# Altium schematic sheet analog.SchDoc: DiPho_analog
size 420 x 297 mm; Author: P. Daniel; CompanyName: WUT ISE; DrawnBy: P. Daniel; Organization: WUT ISE; Address1: PW ISE; Address2: Nowowiejska 15/19 00-665 Warsaw; Address3: piotrmaciejdaniel@gmail.com; Revision: 2; SheetNumber: 1; SheetTotal: 4; ModifiedBy: -; CheckedDate: -; Title2: AFE board for DiPho sensor; DivGrp: WUT ISE; Designer: Piotr Daniel; ModifiedDate: -; ProjectName: Sensor Box
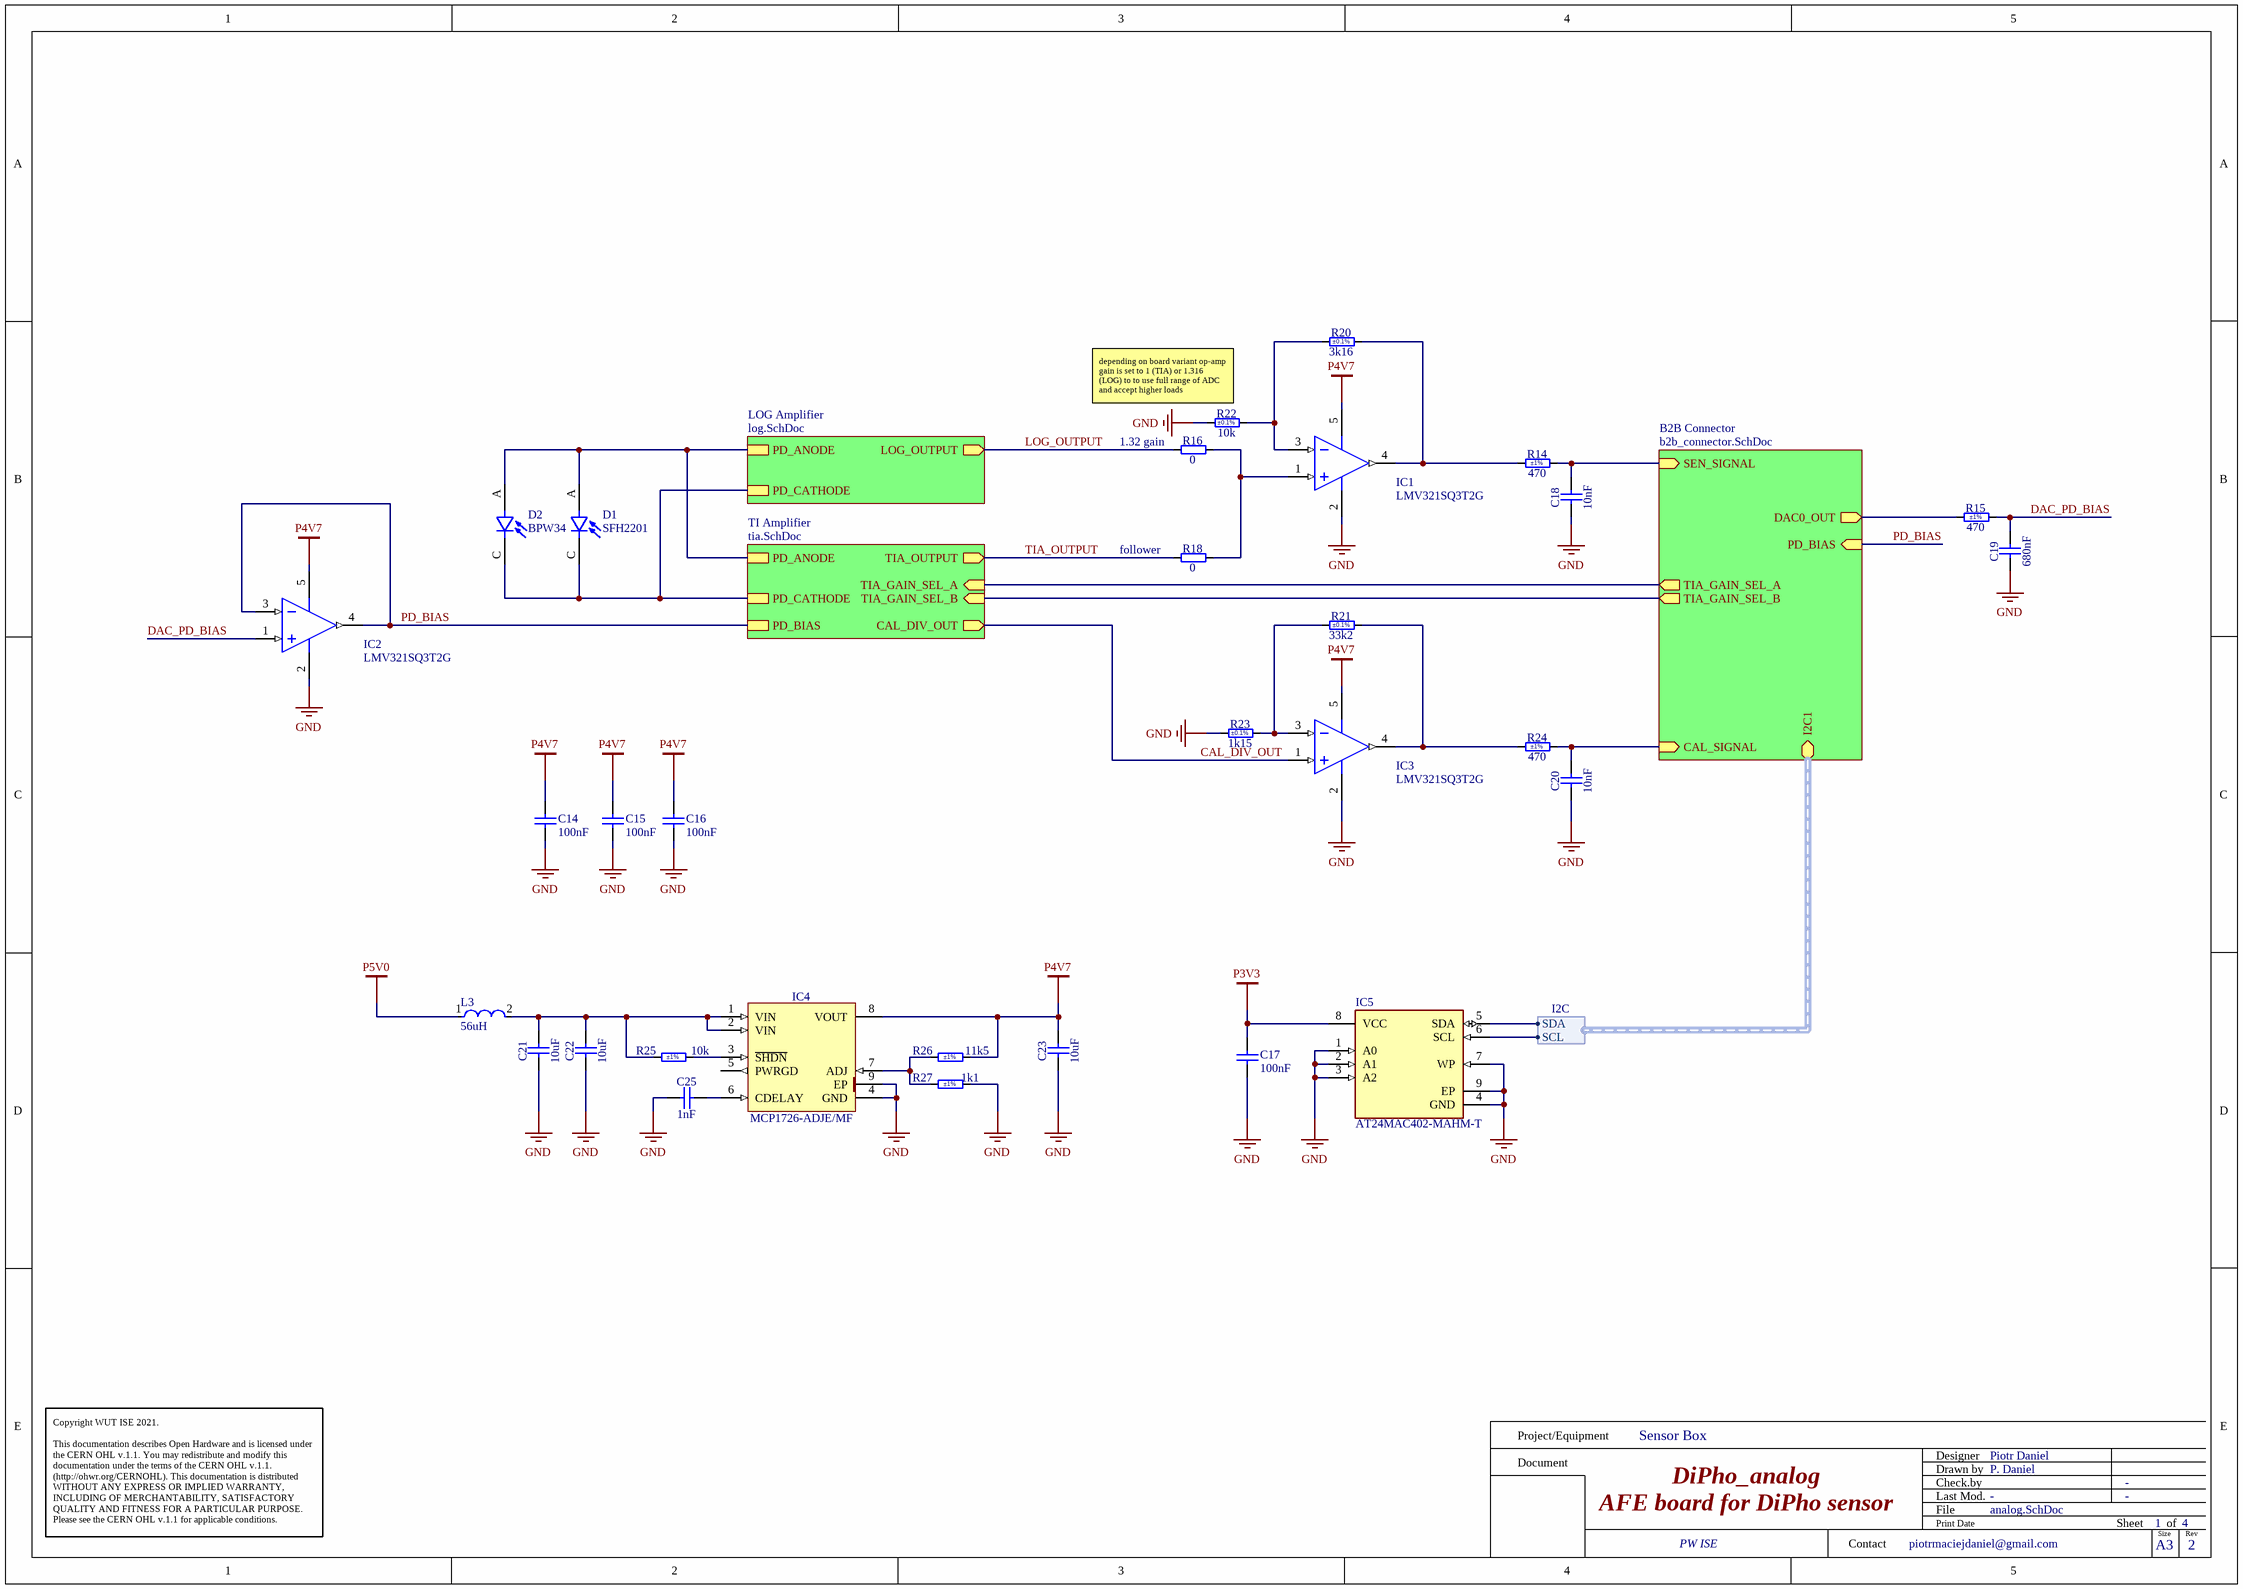
[diagram p0: analog.SchDoc]

## Parts
C14  100nF  [CAPC1005X55N]
C15  100nF  [CAPC1005X55N]
C16  100nF  [CAPC1005X55N]
C17  100nF  [CAPC1005X55N]
C18  10nF  [CAPC1005X55N]
C19  680nF  [CAPC1005X55N]
C20  10nF  [CAPC1005X55N]
C21  10uF  [CAPC2012X135N]
C22  10uF  [CAPC2012X135N]
C23  10uF  [CAPC2012X135N]
C25  1nF  [CAPC1005X55N]
D1  SFH2201  [SFH_2201]
D2  BPW34  [BPW34]
IC1  LMV321SQ3T2G  [ONSC-SC70-5-419A-02_K_N]
IC2  LMV321SQ3T2G  [ONSC-SC70-5-419A-02_K_N]
IC3  LMV321SQ3T2G  [ONSC-SC70-5-419A-02_K_N]
IC4  MCP1726-ADJE/MF  [SON65P300X300X100-9N-R160X240]
IC5  AT24MAC402-MAHM-T  [FP-C04-21355-Q4B-MFG]
L3  56uH  [FP-LQH3NPH_ME-MFG]
R14  470  Tolerance: ±1%  [RESC1005X40N]
R15  470  Tolerance: ±1%  [RESC1005X40N]
R16  0  [RESC1005X40N]
R18  0  [RESC1005X40N]
R20  3k16  Tolerance: ±0.1%  [RESC1005X35N]
R21  33k2  Tolerance: ±0.1%  [RESC1005X40N]
R22  10k  Tolerance: ±0.1%  [RESC1005X35N]
R23  1k15  Tolerance: ±0.1%  [RESC1005X35N]
R24  470  Tolerance: ±1%  [RESC1005X40N]
R25  10k  Tolerance: ±1%  [RESC1005X40N]
R26  11k5  Tolerance: ±1%  [RESC1005X40N]
R27  1k1  Tolerance: ±1%  [RESC1005X40N]

## Sub-sheets
B2B Connector = b2b_connector.SchDoc: TIA_GAIN_SEL_A (out), TIA_GAIN_SEL_B (out), I2C1 (bidir, harness I2C), CAL_SIGNAL (in), SEN_SIGNAL (in), DAC0_OUT (out), PD_BIAS (in)
LOG Amplifier = log.SchDoc: LOG_OUTPUT (out), PD_ANODE, PD_CATHODE
TI Amplifier = tia.SchDoc: PD_ANODE, PD_CATHODE, TIA_OUTPUT (out), TIA_GAIN_SEL_A (in), TIA_GAIN_SEL_B (in), PD_BIAS, CAL_DIV_OUT (out)

## Harnesses
I2C: SCL, SDA

## Nets
GND: C14.1 C15.1 C16.1 C17.1 C18.1 C19.1 C20.1 C21.1 C22.1 C23.1 C25.1 IC1.2(V-) IC2.2(V-) IC3.2(V-) IC4.4(GND) IC4.9(EP) IC5.1(A0) IC5.2(A1) IC5.3(A2) IC5.4(GND) IC5.7(WP) IC5.9(EP) R22.1 R23.1 R27.2
P3V3: C17.2 IC5.8(VCC)
P4V7: C14.2 C15.2 C16.2 C23.2 IC1.5(V+) IC2.5(V+) IC3.5(V+) IC4.8(VOUT) R26.2
P5V0: L3.1
CAL_DIV_OUT: IC3.1(IN+) ; sheet TI Amplifier/CAL_DIV_OUT
DAC_PD_BIAS: C19.2 IC2.1(IN+) R15.2
LOG_OUTPUT: R16.1 ; sheet LOG Amplifier/LOG_OUTPUT
PD_BIAS: IC2.3(IN-) IC2.4(OUT) ; sheet TI Amplifier/PD_BIAS, sheet B2B Connector/PD_BIAS
TIA_OUTPUT: R18.1 ; sheet TI Amplifier/TIA_OUTPUT
NetC18_2: C18.2 R14.2 ; sheet B2B Connector/SEN_SIGNAL
NetC20_2: C20.2 R24.2 ; sheet B2B Connector/CAL_SIGNAL
NetC21_2: C21.2 C22.2 IC4.1(VIN) IC4.2(VIN) L3.2 R25.1
NetC25_2: C25.2 IC4.6(CDELAY)
NetD1_A: D1.A D2.A ; sheet LOG Amplifier/PD_ANODE, sheet TI Amplifier/PD_ANODE
NetD1_C: D1.C D2.C ; sheet LOG Amplifier/PD_CATHODE, sheet TI Amplifier/PD_CATHODE
NetIC1_1: IC1.1(IN+) R16.2 R18.2
NetIC1_3: IC1.3(IN-) R20.1 R22.2
NetIC1_4: IC1.4(OUT) R14.1 R20.2
NetIC3_3: IC3.3(IN-) R21.1 R23.2
NetIC3_4: IC3.4(OUT) R21.2 R24.1
NetIC4_3: IC4.3(~{SHDN}) R25.2
NetIC4_7: IC4.7(ADJ) R26.1 R27.1
NetIC5_5: IC5.5(SDA) ; sheet B2B Connector/I2C1.SDA
NetIC5_6: IC5.6(SCL) ; sheet B2B Connector/I2C1.SCL
NetR15_1: R15.1 ; sheet B2B Connector/DAC0_OUT
(unnamed): sheet TI Amplifier/TIA_GAIN_SEL_A, sheet B2B Connector/TIA_GAIN_SEL_A
(unnamed): sheet TI Amplifier/TIA_GAIN_SEL_B, sheet B2B Connector/TIA_GAIN_SEL_B

Not connected (* = marked no-connect by the designer): IC4 5(PWRGD)

## Notes on the sheet
- (near R22) depending on board variant op-amp gain is set to 1 (TIA) or 1.316 (LOG) to to use full range of ADC and accept higher loads
- (near R16) 1.32 gain
- (near R18) follower
- Project/Equipment
- Document
- Designer
- Drawn by
- Check.by
- Copyright WUT ISE 2021.
  This documentation describes Open Hardware and is licensed under the CERN OHL v.1.1. You may redistribute and modify this documentation under the terms of the CERN OHL v.1.1. (http://ohwr.org/CERNOHL). This documentation is distributed WITHOUT ANY EXPRESS OR IMPLIED WARRANTY, INCLUDING OF MERCHANTABILITY, SATISFACTORY QUALITY AND FITNESS FOR A PARTICULAR PURPOSE. Please see the CERN OHL v.1.1 for applicable conditions.
- Contact
- File
- Last Mod.
- Print Date
- Sheet
- Size
- A3
- of
- Rev

## Library data of the parts
C14-C17 = CC0402_100NF_16V_10%_X7R: Non-polarised capacitor; Manufacturer: GENERIC; Part Description: SMD Multilayer Chip Ceramic Capacitor; Manufacturer1 Part Number: GRM155R71C104KA88D; Tolerance: ±10%; Voltage: 16V; TC: X7R; Part Number: CC0402_100NF_16V_10%_X7R; Component Kind: Standard; Component Type: Standard; Pin Count: 2; Value: 100nF; Status: Not Recommended; Manufacturer Part Number: CC0402_100NF_16V_10%_X7R; Case: 0402; Mounted: Yes; Socket: No; SMD: Yes; Sense: No; Manufacturer1 Example: MURATA; Manufacturer1 ComponentHeight: 0.55mm; HelpURL: \\cern.ch\dfs\Applications\Altium\Datasheets\CC0402_X7R_MURATA_GRM.pdf; Author: CERN DEM JLC; CreateDate: 05.12.2013; LatestRevisionDate: 03.12.2007
C18 C20 = CC0402_10NF_16V_10%_X7R: Non-polarised capacitor; Part Description: SMD Multilayer Chip Ceramic Capacitor; Manufacturer: GENERIC; Manufacturer1 Part Number: 223878715636; Voltage: 16V; TC: X7R; Tolerance: ±10%; Part Number: CC0402_10NF_16V_10%_X7R; Component Kind: Standard; Component Type: Standard; Pin Count: 2; Value: 10nF; Status: Not Recommended; Manufacturer Part Number: CC0402_10NF_16V_10%_X7R; Case: 0402; Mounted: Yes; Socket: No; SMD: Yes; Sense: No; Manufacturer1 Example: PHYCOMP; Manufacturer1 ComponentHeight: 0.55mm; HelpURL: \\cern.ch\dfs\Applications\Altium\Datasheets\CC0402_X7R_PHYCOMP.pdf; Author: CERN DEM JLC; CreateDate: 03.12.2007; LatestRevisionDate: 03.12.2007
C19 = CC0402_680NF_10V_10%_X5R: Non-polarised capacitor; Part Description: SMD Multilayer Chip Ceramic Capacitor; Manufacturer: GENERIC; Manufacturer1 Part Number: GRM155R61A684KE15; Voltage: 10V; TC: X5R; Tolerance: ±10%; Part Number: CC0402_680NF_10V_10%_X5R; Component Kind: Standard; Component Type: Standard; Pin Count: 2; Value: 680nF; Status: None; Manufacturer Part Number: CC0402_680NF_10V_10%_X5R; Case: 0402; Mounted: Yes; Socket: No; SMD: Yes; Sense: No; Manufacturer1 Example: MURATA; Manufacturer1 ComponentHeight: 0.55mm; HelpURL: \\cern.ch\dfs\Applications\Altium\Datasheets\CC0402_X5R_MURATA_GRM.pdf; Author: CERN DEM BC; CreateDate: 19.04.2021; LatestRevisionDate: 19.04.2021
C21-C23 = CC0805_10UF_10V_10%_X7R: Non-polarised capacitor; Part Description: SMD Multilayer Chip Ceramic Capacitor; Manufacturer: GENERIC; Manufacturer1 Part Number: GRM21BR71A106KE51L; Voltage: 10V; TC: X7R; Tolerance: ±10%; Part Number: CC0805_10UF_10V_10%_X7R; Component Kind: Standard; Component Type: Standard; Pin Count: 2; Value: 10uF; Status: Preferred; Manufacturer Part Number: CC0805_10UF_10V_10%_X7R; Case: 0805; Mounted: Yes; Socket: No; SMD: Yes; Sense: No; Manufacturer1 Example: MURATA; Manufacturer1 ComponentHeight: 1.35mm; HelpURL: \\cern.ch\dfs\Applications\Altium\Datasheets\CC0805_X7R_MURATA.pdf; Author: CERN DEM JLC; CreateDate: 30.04.2012; LatestRevisionDate: 30.04.2012
C25 = CC0402_1NF_50V_10%_X7R: Non-polarised capacitor; Part Description: SMD Multilayer Chip Ceramic Capacitor; Manufacturer: GENERIC; Manufacturer1 Part Number: 223858715623; Voltage: 50V; TC: X7R; Tolerance: ±10%; Part Number: CC0402_1NF_50V_10%_X7R; Component Kind: Standard; Component Type: Standard; Pin Count: 2; Value: 1nF; Status: Not Recommended; Manufacturer Part Number: CC0402_1NF_50V_10%_X7R; Case: 0402; Mounted: Yes; Socket: No; SMD: Yes; Sense: No; Manufacturer1 Example: PHYCOMP; Manufacturer1 ComponentHeight: 0.55mm; HelpURL: \\cern.ch\dfs\Applications\Altium\Datasheets\CC0402_X7R_PHYCOMP.pdf; Author: CERN DEM JLC; CreateDate: 03.12.2007; LatestRevisionDate: 03.12.2007
D2 = BPW34: VISHAY - BPW34 - Photodiode, 65 °, 2 nA, 900 nm, DIP-2; Wavelength: 900nm; Rise Time: 100ns; Dark Current: 2nA; Power Dissipation: 215mW; Reverse Breakdown Voltage: 60V; Viewing Angle: 130°; Diode Type: PIN; Lens Style: Clear; Supplier 1: Digi-Key; Manufacturer: Vishay; Manufacturer Part Number: BPW34; RoHS: Yes; Category: Photodiodes; Stock 1: 56; Pricing 1: 1=1,06000, 10=0,94400, 100=0,73630, 500=0,60822, 1000=0,48018, 2000=0,45300 (USD); Mount: Through Hole,PCB; Case/Package: DIP; Number of Pins: 2; Contact Plating: Tin; Min Operating Temperature: -40°C; Max Operating Temperature: 100°C; Fall Time: 100ns; Packaging: Bulk; Max Reverse Voltage (DC): 60V; Package Quantity: 3000; Max Power Dissipation: 215mW; Reverse Voltage (DC): 60V; Breakdown Voltage: 60V; Length: 4.5mm; Width: 4.3mm; Height: 2mm; Radiation Hardening: No; REACH SVHC: Unknown; Lead Free: Lead Free; ComponentLink1URL: https://datasheet.ciiva.com/1248/33605-1248690.pdf?src-supplier=Element14; ComponentLink1Description: https://datasheet.ciiva.com/1248/33605-1248690.pdf?src-supplier=Element14; ComponentLink2URL: https://datasheet.ciiva.com/1249/bpw34-1249073.pdf?src-supplier=Element14; ComponentLink2Description: https://datasheet.ciiva.com/1249/bpw34-1249073.pdf?src-supplier=Element14; ComponentLink3URL: https://datasheet.ciiva.com/25620/0900766b80de9fc5-25620357.pdf?src-supplier=RSComponents; ComponentLink3Description: https://datasheet.ciiva.com/25620/0900766b80de9fc5-25620357.pdf?src-supplier=RSComponents; ComponentLink4URL: https://datasheet.ciiva.com/4697/bpw34-79369-4697616.pdf?src-supplier=Mouser; ComponentLink4Description: https://datasheet.ciiva.com/4697/bpw34-79369-4697616.pdf?src-supplier=Mouser; ComponentLink5URL: https://datasheet.ciiva.com/1336/6514-1336219.pdf?src-supplier=Newark; ComponentLink5Description: https://datasheet.ciiva.com/1336/6514-1336219.pdf?src-supplier=Newark; ComponentLink6URL: https://datasheet.ciiva.com/4269/2bpw34-4269812.pdf?src-supplier=Arrow+Electronics; ComponentLink6Description: https://datasheet.ciiva.com/4269/2bpw34-4269812.pdf?src-supplier=Arrow+Electronics; ComponentLink7URL: https://datasheet.ciiva.com/15117/getdatasheetpartid-112064-15117125.pdf?src-supplier=Verical; ComponentLink7Description: https://datasheet.ciiva.com/15117/getdatasheetpartid-112064-15117125.pdf?src-supplier=Verical; ComponentLink8URL: https://datasheet.ciiva.com/1248/bpw34-1248686.pdf?src-supplier=Element14; ComponentLink8Description: https://datasheet.ciiva.com/1248/bpw34-1248686.pdf?src-supplier=Element14; ComponentLink9URL: https://datasheet.ciiva.com/1335/1809684-1335889.pdf?src-supplier=Newark; ComponentLink9Description: https://datasheet.ciiva.com/1335/1809684-1335889.pdf?src-supplier=Newark; ComponentLink10URL: https://datasheet.ciiva.com/2819/bpw34-2819744.pdf?src-supplier=Digi-Key; ComponentLink10Description: https://datasheet.ciiva.com/2819/bpw34-2819744.pdf?src-supplier=Digi-Key; ComponentLink11URL: https://datasheet.ciiva.com/8084/bpw34-8084840.pdf?src-supplier=Avnet; ComponentLink11Description: https://datasheet.ciiva.com/8084/bpw34-8084840.pdf?src-supplier=Avnet; Supplier Part Number 1: 751-1015-ND
IC1-IC3 = CMP-1310-00136-1: Single Low-Voltage, Rail-to-Rail Operational Amplifier, 2.7 to 5.5 V, -40 to 85 degC, 5-Pin SC70, Pb-Free, Tape and Reel; Manufacturer: On Semiconductor; VCC Max (V): 5.5; VCC Min (V): 2.7; SR Typ (V/uS): 1; ComponentLink2Description: Datasheet; ComponentLink1URL: http://www.onsemi.com/; DatasheetVersion: Rev. 10; PackageDescription: 5-Pin Small Outline Transistor, Body 2 x 1.25 mm, Pitch 0.65 mm; PartNumber: LMV321SQ3T2G; Packing: Tape and Reel; PackageVersion: Rev. K, 07/2010; ComponentLink1Description: Manufacturer URL; PackageReference: SC70-5-419A-02_K; ComponentLink3Description: Package Specification; GBW Typ (MHz): 1; ComponentLink3URL: http://www.onsemi.cn/pub_link/Collateral/LMV821-D.PDF; ComponentLink2URL: http://www.onsemi.cn/pub_link/Collateral/LMV321-LMV358-LMV324-D.PDF; Mounting Technology: Surface Mount; RoHS: TRUE
IC4 = MCP1726-ADJE/MF: 1A, 0.8V to 5.0V Adjustable , Low Quiescent Current LDO Regulator; Manufacturer: MICROCHIP TECHNOLOGY; PressFit: No; Bonding: No; Part Number: MCP1726-ADJE/MF; Component Kind: Standard; Component Type: Standard; Device: MCP1726-ADJE/MF; PackageDescription: SON, 0.65mm pitch, 8 pin, 3mm X 3mm X 1.00mm H body (w/thermal tab 1.60 X 2.4mm),  IPC Medium Density; Part Description: 1A, 0.8V to 5.0V Adjustable, Low Quiescent Current LDO Regulator; Manufacturer Part Number: MCP1726-ADJE/MF; Pin Count: 8; Case: SON8; Mounted: Yes; Socket: No; SMD: Yes; Sense: No; ComponentHeight: 1mm; HelpURL: \\cern.ch\dfs\Applications\Altium\Datasheets\MCP1726-ADJE-MF.pdf; Author: CERN DEM JLC; CreateDate: 07.02.2012; LatestRevisionDate: 07.02.2012
IC5 = CMP-06313-000089-1: IC EEPROM 2K I2C 1MHZ 8UDFN; Memory Size: 2Kb; Access Time: 550ns; Memory Type: Non-Volatile; Max Operating Temperature: 85°C; Frequency: 1MHz; Min Operating Temperature: -40°C; Packaging: Cut Tape; RoHS Compliant: Yes; Mount: Surface Mount
L3 = CMP-06042-011728-1: Wire Wound Ferrite Inductor for Power Lines 56μH ±20% 1.2Ω 500mA 1212
R14 R15 R24 = R0402_470R_1%_0.0625W_100PPM: Resistor - 1%; Part Description: General Purpose Thick Film Chip Resistor; Manufacturer: GENERIC; Manufacturer1 Part Number: 232270674701L; TC: ±100ppm/°C; PressFit: No; Part Number: R0402_470R_1%_0.0625W_100PPM; Component Kind: Standard; Component Type: Standard; Pin Count: 2; Value: 470; Status: Not Recommended; Power: 0.0625W; Manufacturer Part Number: R0402_470R_1%_0.0625W_100PPM; Case: 0402; Mounted: Yes; Sense: No; Socket: No; SMD: Yes; Manufacturer1 Example: YAGEO PHYCOMP; Manufacturer1 ComponentHeight: 0.4mm; HelpURL: \\cern.ch\dfs\Applications\Altium\Datasheets\R0402_Phycomp_RC0402.pdf; Author: CERN DEM JLC; CreateDate: 03.12.2007; LatestRevisionDate: 17.10.2012
R16 R18 = R0402_0R_JUMPER: Resistor; Part Description: 1A (0.05R Max DC Resistance) Zero Ohm Jumper; Manufacturer: GENERIC; Manufacturer1 Part Number: 232270591001L; PressFit: No; Part Number: R0402_0R_JUMPER; Component Kind: Standard; Component Type: Standard; Pin Count: 2; Value: 0; Status: Not Recommended; Manufacturer Part Number: R0402_0R_JUMPER; Case: 0402; Mounted: Yes; Sense: No; Socket: No; SMD: Yes; Manufacturer1 Example: YAGEO PHYCOMP; Manufacturer1 ComponentHeight: 0.4mm; HelpURL: \\cern.ch\dfs\Applications\Altium\Datasheets\R0402_Phycomp_RC0402.pdf; Author: CERN DEM JLC; CreateDate: 03.12.2007; LatestRevisionDate: 17.10.2012
R20 R23 = R0402_10K_0.1%_0.063W_25PPM: Resistor - 0.1%; Part Description: Thin Film Precision Resistor; Manufacturer: GENERIC; Manufacturer1 Part Number: CPF0402B10KE1; Value: 10k; Power: 0.063W; TC: ±25ppm/°C; PressFit: No; Part Number: R0402_10K_0.1%_0.063W_25PPM; Component Kind: Standard; Component Type: Standard; Pin Count: 2; Status: Not Recommended; Manufacturer Part Number: R0402_10K_0.1%_0.063W_25PPM; Case: 0402; Mounted: Yes; Sense: No; Socket: No; SMD: Yes; Manufacturer1 Example: TE CONNECTIVITY; Manufacturer1 ComponentHeight: 0.35mm; HelpURL: \\cern.ch\dfs\Applications\Altium\Datasheets\R0402_TYCO_CPF.pdf; Author: CERN DEM JMW; CreateDate: 22.09.2015; LatestRevisionDate: 22.09.2015
R21 = R0402_33K2_0.1%_0.063W_25PPM: Resistor - 0.1%; Part Description: Thin Film Precision Resistor; Manufacturer: GENERIC; Manufacturer1 Part Number: ERA2AEB3322X; Power: 0.063W; TC: ±25ppm/°C; Voltage: 50V; PressFit: No; Part Number: R0402_33K2_0.1%_0.063W_25PPM; Component Kind: Standard; Component Type: Standard; Pin Count: 2; Value: 33k2; Status: Not Recommended; Manufacturer Part Number: R0402_33K2_0.1%_0.063W_25PPM; Case: 0402; Mounted: Yes; Sense: No; Socket: No; SMD: Yes; Manufacturer1 Example: PANASONIC; Manufacturer1 ComponentHeight: 0.4mm; HelpURL: \\cern.ch\dfs\Applications\Altium\Datasheets\R0402_PANASONIC_ERA.pdf; Author: CERN DEM BC; CreateDate: 09.07.2020; LatestRevisionDate: 09.07.2020
R22 = R0402_10K_0.1%_0.063W_25PPM: Resistor - 0.1%; Part Description: Thin Film Precision Resistor; Manufacturer: GENERIC; Manufacturer1 Part Number: CPF0402B10KE1; Power: 0.063W; TC: ±25ppm/°C; PressFit: No; Part Number: R0402_10K_0.1%_0.063W_25PPM; Component Kind: Standard; Component Type: Standard; Pin Count: 2; Value: 10k; Status: Not Recommended; Manufacturer Part Number: R0402_10K_0.1%_0.063W_25PPM; Case: 0402; Mounted: Yes; Sense: No; Socket: No; SMD: Yes; Manufacturer1 Example: TE CONNECTIVITY; Manufacturer1 ComponentHeight: 0.35mm; HelpURL: \\cern.ch\dfs\Applications\Altium\Datasheets\R0402_TYCO_CPF.pdf; Author: CERN DEM JMW; CreateDate: 22.09.2015; LatestRevisionDate: 22.09.2015
R25 = R0402_10K_1%_0.0625W_100PPM: Resistor - 1%; Part Description: General Purpose Thick Film Chip Resistor; Manufacturer: GENERIC; Manufacturer1 Part Number: 232270671003L; TC: ±100ppm/°C; PressFit: No; Part Number: R0402_10K_1%_0.0625W_100PPM; Component Kind: Standard; Component Type: Standard; Pin Count: 2; Value: 10k; Status: Not Recommended; Power: 0.0625W; Manufacturer Part Number: R0402_10K_1%_0.0625W_100PPM; Case: 0402; Mounted: Yes; Sense: No; Socket: No; SMD: Yes; Manufacturer1 Example: YAGEO PHYCOMP; Manufacturer1 ComponentHeight: 0.4mm; HelpURL: \\cern.ch\dfs\Applications\Altium\Datasheets\R0402_Phycomp_RC0402.pdf; Author: CERN DEM JLC; CreateDate: 03.12.2007; LatestRevisionDate: 17.10.2012
R26 = R0402_11K5_1%_0.063W_100PPM: Resistor - 1%; Part Description: Standard Thick Film Chip Resistor; Manufacturer: GENERIC; Manufacturer1 Part Number: CRCW040211K5FK; Power: 0.063W; TC: ±100ppm/°C; PressFit: No; Part Number: R0402_11K5_1%_0.063W_100PPM; Component Kind: Standard; Component Type: Standard; Pin Count: 2; Value: 11k5; Status: None; Manufacturer Part Number: R0402_11K5_1%_0.063W_100PPM; Case: 0402; Mounted: Yes; Sense: No; Socket: No; SMD: Yes; Manufacturer1 Example: VISHAY; Manufacturer1 ComponentHeight: 0.4mm; HelpURL: \\cern.ch\dfs\Applications\Altium\Datasheets\R0402_VISHAY_CRCW e3.pdf; Author: CERN DEM BC; CreateDate: 02.06.2020; LatestRevisionDate: 02.06.2020
R27 = R0402_1K1_1%_0.0625W_100PPM: Resistor - 1%; Part Description: General Purpose Thick Film Chip Resistor; Manufacturer: GENERIC; Manufacturer1 Part Number: 232270671102L; TC: ±100ppm/°C; PressFit: No; Part Number: R0402_1K1_1%_0.0625W_100PPM; Component Kind: Standard; Component Type: Standard; Pin Count: 2; Value: 1k1; Status: Not Recommended; Power: 0.0625W; Manufacturer Part Number: R0402_1K1_1%_0.0625W_100PPM; Case: 0402; Mounted: Yes; Sense: No; Socket: No; SMD: Yes; Manufacturer1 Example: YAGEO PHYCOMP; Manufacturer1 ComponentHeight: 0.4mm; HelpURL: \\cern.ch\dfs\Applications\Altium\Datasheets\R0402_Phycomp_RC0402.pdf; Author: CERN DEM JLC; CreateDate: 03.12.2007; LatestRevisionDate: 17.10.2012